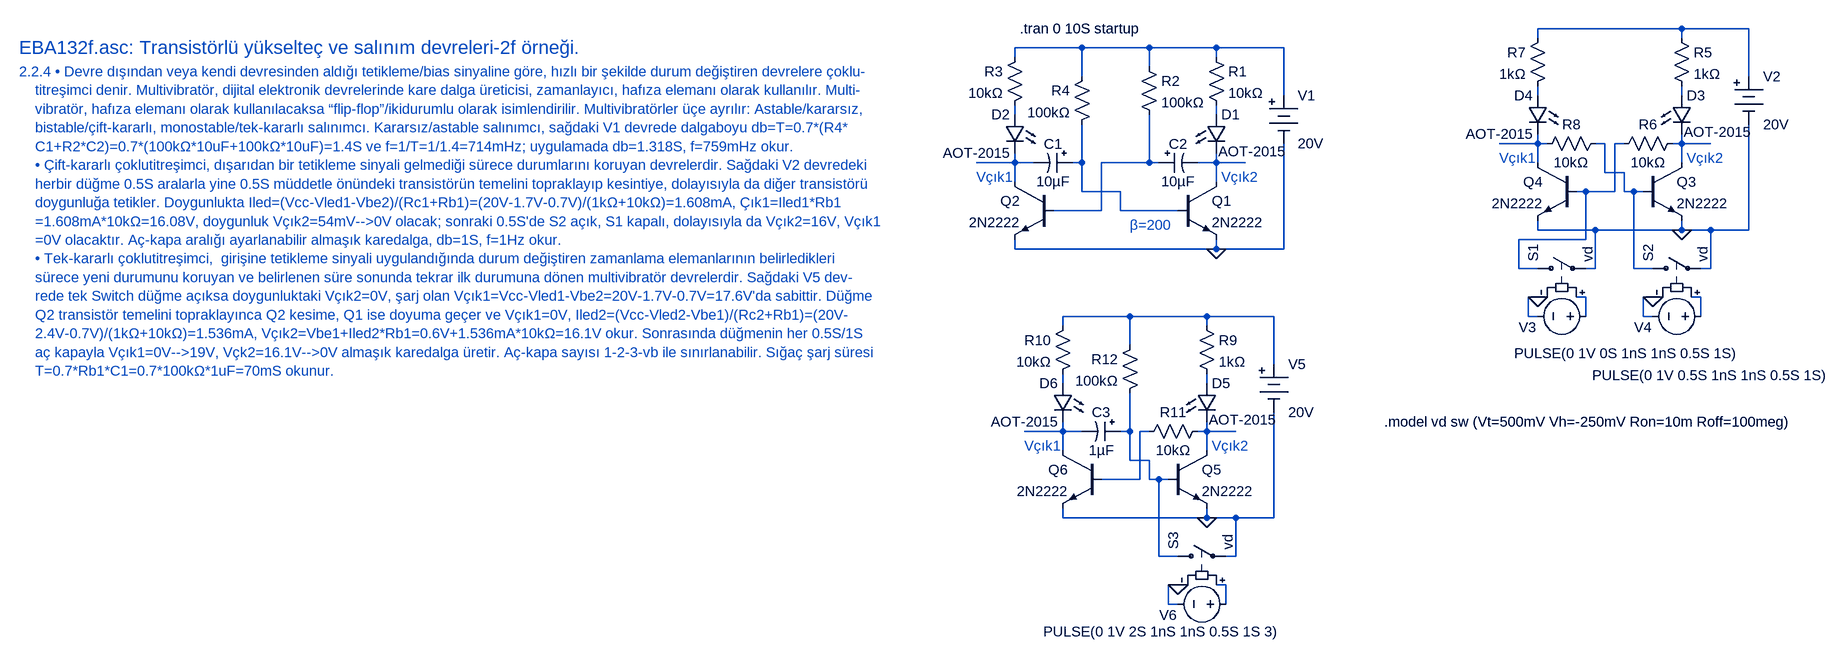
[diagram p0: schematic EBA132f.asc]
EBA132f.asc, the LTspice schematic file:
Version 4
SHEET 1 5332 4332
WIRE 2896 16 2656 16
WIRE 3008 16 2896 16
WIRE 2656 32 2656 16
WIRE 2896 32 2896 16
WIRE 1888 48 1776 48
WIRE 2000 48 1888 48
WIRE 2112 48 2000 48
WIRE 2224 48 2112 48
WIRE 1776 64 1776 48
WIRE 2112 64 2112 48
WIRE 2000 80 2000 48
WIRE 1888 96 1888 48
WIRE 3008 96 3008 16
WIRE 2224 128 2224 48
WIRE 2656 128 2656 112
WIRE 2896 128 2896 112
WIRE 1776 160 1776 144
WIRE 2112 160 2112 144
WIRE 2656 208 2656 192
WIRE 2656 208 2592 208
WIRE 2672 208 2656 208
WIRE 2768 208 2752 208
WIRE 2800 208 2784 208
WIRE 2896 208 2896 192
WIRE 2896 208 2880 208
WIRE 2944 208 2896 208
WIRE 1776 240 1776 224
WIRE 1776 240 1712 240
WIRE 1808 240 1776 240
WIRE 1888 240 1888 176
WIRE 1888 240 1872 240
WIRE 2000 240 2000 160
WIRE 2000 240 1920 240
WIRE 2016 240 2000 240
WIRE 2112 240 2112 224
WIRE 2112 240 2080 240
WIRE 2160 240 2112 240
WIRE 2656 240 2656 208
WIRE 2896 240 2896 208
WIRE 2768 256 2768 208
WIRE 2800 256 2768 256
WIRE 1776 272 1776 240
WIRE 2112 272 2112 240
WIRE 1888 288 1888 240
WIRE 1952 288 1888 288
WIRE 2736 288 2720 288
WIRE 2784 288 2784 208
WIRE 2784 288 2736 288
WIRE 2800 288 2800 256
WIRE 2816 288 2800 288
WIRE 2832 288 2816 288
WIRE 1920 320 1920 240
WIRE 1920 320 1840 320
WIRE 1952 320 1952 288
WIRE 2048 320 1952 320
WIRE 2656 352 2656 336
WIRE 2752 352 2656 352
WIRE 2896 352 2896 336
WIRE 2896 352 2752 352
WIRE 2944 352 2896 352
WIRE 3008 352 3008 176
WIRE 3008 352 2944 352
WIRE 2736 368 2736 288
WIRE 2736 368 2624 368
WIRE 1776 384 1776 368
WIRE 2112 384 2112 368
WIRE 2112 384 1776 384
WIRE 2224 384 2224 208
WIRE 2224 384 2112 384
WIRE 2624 416 2624 368
WIRE 2656 416 2624 416
WIRE 2752 416 2752 352
WIRE 2752 416 2736 416
WIRE 2816 416 2816 288
WIRE 2848 416 2816 416
WIRE 2944 416 2944 352
WIRE 2944 416 2928 416
WIRE 2656 464 2640 464
WIRE 2672 464 2656 464
WIRE 2736 464 2720 464
WIRE 2848 464 2832 464
WIRE 2864 464 2848 464
WIRE 2928 464 2912 464
WIRE 1968 496 1856 496
WIRE 2096 496 1968 496
WIRE 2208 496 2096 496
WIRE 2640 496 2640 464
WIRE 2656 496 2640 496
WIRE 2736 496 2736 464
WIRE 2832 496 2832 464
WIRE 2848 496 2832 496
WIRE 2928 496 2928 464
WIRE 1856 512 1856 496
WIRE 2096 512 2096 496
WIRE 1968 544 1968 496
WIRE 2208 576 2208 496
WIRE 1856 608 1856 592
WIRE 2096 608 2096 592
WIRE 1856 688 1856 672
WIRE 1856 688 1792 688
WIRE 1888 688 1856 688
WIRE 1968 688 1968 624
WIRE 1968 688 1952 688
WIRE 2000 688 1984 688
WIRE 2096 688 2096 672
WIRE 2096 688 2080 688
WIRE 2144 688 2096 688
WIRE 1856 720 1856 688
WIRE 2096 720 2096 688
WIRE 1968 736 1968 688
WIRE 2000 736 1968 736
WIRE 1984 768 1984 688
WIRE 1984 768 1920 768
WIRE 2000 768 2000 736
WIRE 2016 768 2000 768
WIRE 2032 768 2016 768
WIRE 1856 832 1856 816
WIRE 2096 832 2096 816
WIRE 2096 832 1856 832
WIRE 2144 832 2096 832
WIRE 2208 832 2208 656
WIRE 2208 832 2144 832
WIRE 2016 896 2016 768
WIRE 2048 896 2016 896
WIRE 2144 896 2144 832
WIRE 2144 896 2128 896
WIRE 2048 944 2032 944
WIRE 2064 944 2048 944
WIRE 2128 944 2112 944
WIRE 2032 976 2032 944
WIRE 2048 976 2032 976
WIRE 2128 976 2128 944
FLAG 2112 384 0
FLAG 2896 352 0
FLAG 2656 464 0
FLAG 2848 464 0
FLAG 2096 832 0
FLAG 2048 944 0
SYMBOL res 2096 48 R0
SYMATTR InstName R1
SYMATTR Value 10kΩ
SYMBOL npn 2048 272 R0
SYMATTR InstName Q1
SYMATTR Value 2N2222
SYMBOL LED 2096 160 R0
WINDOW 3 19 61 Left 2
SYMATTR Value AOT-2015
SYMATTR InstName D1
SYMATTR Description Diode
SYMATTR Type diode
SYMBOL res 1984 64 R0
SYMATTR InstName R2
SYMATTR Value 100kΩ
SYMBOL res 1792 48 M0
SYMATTR InstName R3
SYMATTR Value 10kΩ
SYMBOL npn 1840 272 M0
SYMATTR InstName Q2
SYMATTR Value 2N2222
SYMBOL LED 1792 160 M0
SYMATTR InstName D2
SYMATTR Value AOT-2015
SYMATTR Description Diode
SYMATTR Type diode
SYMBOL res 1904 80 M0
SYMATTR InstName R4
SYMATTR Value 100kΩ
SYMBOL polcap 1872 224 R90
WINDOW 0 0 32 VBottom 2
WINDOW 3 32 32 VTop 2
SYMATTR InstName C1
SYMATTR Value 10µF
SYMBOL polcap 2016 224 M90
WINDOW 0 0 32 VBottom 2
WINDOW 3 32 32 VTop 2
SYMATTR InstName C2
SYMATTR Value 10µF
SYMBOL Misc\\battery 2224 112 R0
SYMATTR InstName V1
SYMATTR Value 20V
SYMBOL res 2880 16 R0
SYMATTR InstName R5
SYMATTR Value 1kΩ
SYMBOL npn 2832 240 R0
SYMATTR InstName Q3
SYMATTR Value 2N2222
SYMBOL LED 2880 128 R0
WINDOW 3 19 61 Left 2
SYMATTR Value AOT-2015
SYMATTR InstName D3
SYMATTR Description Diode
SYMATTR Type diode
SYMBOL res 2672 16 M0
SYMATTR InstName R7
SYMATTR Value 1kΩ
SYMBOL npn 2720 240 M0
SYMATTR InstName Q4
SYMATTR Value 2N2222
SYMBOL LED 2672 128 M0
SYMATTR InstName D4
SYMATTR Value AOT-2015
SYMATTR Description Diode
SYMATTR Type diode
SYMBOL Misc\\battery 3008 80 R0
SYMATTR InstName V2
SYMATTR Value 20V
SYMBOL res 2896 192 R90
WINDOW 0 0 56 VBottom 2
WINDOW 3 32 56 VTop 2
SYMATTR InstName R6
SYMATTR Value 10kΩ
SYMBOL res 2768 192 R90
WINDOW 0 0 56 VBottom 2
WINDOW 3 32 56 VTop 2
SYMATTR InstName R8
SYMATTR Value 10kΩ
SYMBOL sw 2640 416 R270
WINDOW 0 11 9 Left 2
WINDOW 3 10 100 Left 2
SYMATTR InstName S1
SYMATTR Value vd
SYMBOL voltage 2752 496 R90
WINDOW 0 19 98 VRight 2
WINDOW 3 62 -236 VRight 2
WINDOW 123 0 0 Left 0
WINDOW 39 0 0 Left 0
SYMATTR InstName V3
SYMATTR Value PULSE(0 1V 0S 1nS 1nS 0.5S 1S)
SYMBOL sw 2832 416 R270
WINDOW 0 11 9 Left 2
WINDOW 3 10 100 Left 2
SYMATTR InstName S2
SYMATTR Value vd
SYMBOL voltage 2944 496 R90
WINDOW 0 19 98 VRight 2
WINDOW 3 99 -194 VRight 2
WINDOW 123 0 0 Left 0
WINDOW 39 0 0 Left 0
SYMATTR InstName V4
SYMATTR Value PULSE(0 1V 0.5S 1nS 1nS 0.5S 1S)
SYMBOL res 2080 496 R0
SYMATTR InstName R9
SYMATTR Value 1kΩ
SYMBOL npn 2032 720 R0
SYMATTR InstName Q5
SYMATTR Value 2N2222
SYMBOL LED 2080 608 R0
WINDOW 3 19 61 Left 2
SYMATTR Value AOT-2015
SYMATTR InstName D5
SYMATTR Description Diode
SYMATTR Type diode
SYMBOL Misc\\battery 2208 560 R0
SYMATTR InstName V5
SYMATTR Value 20V
SYMBOL res 2096 672 R90
WINDOW 0 0 56 VBottom 2
WINDOW 3 32 56 VTop 2
SYMATTR InstName R11
SYMATTR Value 10kΩ
SYMBOL sw 2032 896 R270
WINDOW 0 11 9 Left 2
WINDOW 3 10 100 Left 2
SYMATTR InstName S3
SYMATTR Value vd
SYMBOL voltage 2144 976 R90
WINDOW 0 19 98 VRight 2
WINDOW 3 46 -71 VRight 2
WINDOW 123 0 0 Left 0
WINDOW 39 0 0 Left 0
SYMATTR InstName V6
SYMATTR Value PULSE(0 1V 2S 1nS 1nS 0.5S 1S 3)
SYMBOL res 1872 496 M0
SYMATTR InstName R10
SYMATTR Value 10kΩ
SYMBOL npn 1920 720 M0
SYMATTR InstName Q6
SYMATTR Value 2N2222
SYMBOL LED 1872 608 M0
SYMATTR InstName D6
SYMATTR Value AOT-2015
SYMATTR Description Diode
SYMATTR Type diode
SYMBOL res 1984 528 M0
SYMATTR InstName R12
SYMATTR Value 100kΩ
SYMBOL polcap 1952 672 R90
WINDOW 0 0 32 VBottom 2
WINDOW 3 32 32 VTop 2
SYMATTR InstName C3
SYMATTR Value 1µF
TEXT -224 48 Left 3 ;EBA132f.asc: Transistörlü yükselteç ve salınım devreleri-2f örneği.
TEXT -224 88 Left 2 ;2.2.4 • Devre dışından veya kendi devresinden aldığı tetikleme/bias sinyaline göre, hızlı bir şekilde durum değiştiren devrelere çoklu-\n    titreşimci denir. Multivibratör, dijital elektronik devrelerinde kare dalga üreticisi, zamanlayıcı, hafıza elemanı olarak kullanılır. Multi-\n    vibratör, hafıza elemanı olarak kullanılacaksa “flip-flop”/ikidurumlu olarak isimlendirilir. Multivibratörler üçe ayrılır: Astable/kararsız,\n    bistable/çift-kararlı, monostable/tek-kararlı salınımcı. Kararsız/astable salınımcı, sağdaki V1 devrede dalgaboyu db=T=0.7*(R4*\n    C1+R2*C2)=0.7*(100kΩ*10uF+100kΩ*10uF)=1.4S ve f=1/T=1/1.4=714mHz; uygulamada db=1.318S, f=759mHz okur.\n    • Çift-kararlı çoklutitreşimci, dışarıdan bir tetikleme sinyali gelmediği sürece durumlarını koruyan devrelerdir. Sağdaki V2 devredeki\n    herbir düğme 0.5S aralarla yine 0.5S müddetle önündeki transistörün temelini topraklayıp kesintiye, dolayısıyla da diğer transistörü\n    doygunluğa tetikler. Doygunlukta Iled=(Vcc-Vled1-Vbe2)/(Rc1+Rb1)=(20V-1.7V-0.7V)/(1kΩ+10kΩ)=1.608mA, Çık1=Iled1*Rb1\n    =1.608mA*10kΩ=16.08V, doygunluk Vçık2=54mV-->0V olacak; sonraki 0.5S'de S2 açık, S1 kapalı, dolayısıyla da Vçık2=16V, Vçık1\n    =0V olacaktır. Aç-kapa aralığı ayarlanabilir almaşık karedalga, db=1S, f=1Hz okur.\n    • Tek-kararlı çoklutitreşimci,  girişine tetikleme sinyali uygulandığında durum değiştiren zamanlama elemanlarının belirledikleri \n    sürece yeni durumunu koruyan ve belirlenen süre sonunda tekrar ilk durumuna dönen multivibratör devrelerdir. Sağdaki V5 dev-\n    rede tek Switch düğme açıksa doygunluktaki Vçık2=0V, şarj olan Vçık1=Vcc-Vled1-Vbe2=20V-1.7V-0.7V=17.6V'da sabittir. Düğme\n    Q2 transistör temelini topraklayınca Q2 kesime, Q1 ise doyuma geçer ve Vçık1=0V, Iled2=(Vcc-Vled2-Vbe1)/(Rc2+Rb1)=(20V-\n    2.4V-0.7V)/(1kΩ+10kΩ)=1.536mA, Vçık2=Vbe1+Iled2*Rb1=0.6V+1.536mA*10kΩ=16.1V okur. Sonrasında düğmenin her 0.5S/1S\n    aç kapayla Vçık1=0V-->19V, Vçk2=16.1V-->0V almaşık karedalga üretir. Aç-kapa sayısı 1-2-3-vb ile sınırlanabilir. Sığaç şarj süresi\n    T=0.7*Rb1*C1=0.7*100kΩ*1uF=70mS okunur.
TEXT 1968 344 Left 2 ;β=200
TEXT 1712 264 Left 2 ;Vçık1
TEXT 2120 264 Left 2 ;Vçık2
TEXT 1784 16 Left 2 !.tran 0 10S startup
TEXT 2592 232 Left 2 ;Vçık1
TEXT 2904 232 Left 2 ;Vçık2
TEXT 2400 672 Left 2 !.model vd sw (Vt=500mV Vh=-250mV Ron=10m Roff=100meg)
TEXT 2104 712 Left 2 ;Vçık2
TEXT 1792 712 Left 2 ;Vçık1

The netlist it stands for:
* EBA132f.asc
R1 N002 N006 10kΩ
Q1 N014 N012 0 0 2N2222
D1 N006 N014 AOT-2015
R2 N002 N013 100kΩ
R3 N002 N005 10kΩ
Q2 N011 N013 0 0 2N2222
D2 N005 N011 AOT-2015
R4 N002 N012 100kΩ
C1 N012 N011 10µF
C2 N013 N014 10µF
V1 N002 0 20V
R5 N001 N004 1kΩ
Q3 N010 N008 0 0 2N2222
D3 N004 N010 AOT-2015
R7 N001 N003 1kΩ
Q4 N007 N009 0 0 2N2222
D4 N003 N007 AOT-2015
V2 N001 0 20V
R6 N010 N009 10kΩ
R8 N008 N007 10kΩ
S1 N009 0 N015 0 vd
V3 N015 0 PULSE(0 1V 0S 1nS 1nS 0.5S 1S)
S2 N008 0 N016 0 vd
V4 N016 0 PULSE(0 1V 0.5S 1nS 1nS 0.5S 1S)
R9 N017 N019 1kΩ
Q5 N023 N021 0 0 2N2222
D5 N019 N023 AOT-2015
V5 N017 0 20V
R11 N023 N022 10kΩ
S3 N021 0 N024 0 vd
V6 N024 0 PULSE(0 1V 2S 1nS 1nS 0.5S 1S 3)
R10 N017 N018 10kΩ
Q6 N020 N022 0 0 2N2222
D6 N018 N020 AOT-2015
R12 N017 N021 100kΩ
C3 N021 N020 1µF
.model D D
.lib standard.dio
.model NPN NPN
.model PNP PNP
.lib standard.bjt
* EBA132f.asc: Transistörlü yükselteç ve salınım devreleri-2f örneği.
* 2.2.4 • Devre dışından veya kendi devresinden aldığı tetikleme/bias sinyaline göre, hızlı bir şekilde durum değiştiren devrelere çoklu-
*     titreşimci denir. Multivibratör, dijital elektronik devrelerinde kare dalga üreticisi, zamanlayıcı, hafıza elemanı olarak kullanılır. Multi-
*     vibratör, hafıza elemanı olarak kullanılacaksa “flip-flop”/ikidurumlu olarak isimlendirilir. Multivibratörler üçe ayrılır: Astable/kararsız,
*     bistable/çift-kararlı, monostable/tek-kararlı salınımcı. Kararsız/astable salınımcı, sağdaki V1 devrede dalgaboyu db=T=0.7*(R4*
*     C1+R2*C2)=0.7*(100kΩ*10uF+100kΩ*10uF)=1.4S ve f=1/T=1/1.4=714mHz; uygulamada db=1.318S, f=759mHz okur.
*     • Çift-kararlı çoklutitreşimci, dışarıdan bir tetikleme sinyali gelmediği sürece durumlarını koruyan devrelerdir. Sağdaki V2 devredeki
*     herbir düğme 0.5S aralarla yine 0.5S müddetle önündeki transistörün temelini topraklayıp kesintiye, dolayısıyla da diğer transistörü
*     doygunluğa tetikler. Doygunlukta Iled=(Vcc-Vled1-Vbe2)/(Rc1+Rb1)=(20V-1.7V-0.7V)/(1kΩ+10kΩ)=1.608mA, Çık1=Iled1*Rb1
*     =1.608mA*10kΩ=16.08V, doygunluk Vçık2=54mV-->0V olacak; sonraki 0.5S'de S2 açık, S1 kapalı, dolayısıyla da Vçık2=16V, Vçık1
*     =0V olacaktır. Aç-kapa aralığı ayarlanabilir almaşık karedalga, db=1S, f=1Hz okur.
*     • Tek-kararlı çoklutitreşimci,  girişine tetikleme sinyali uygulandığında durum değiştiren zamanlama elemanlarının belirledikleri
*     sürece yeni durumunu koruyan ve belirlenen süre sonunda tekrar ilk durumuna dönen multivibratör devrelerdir. Sağdaki V5 dev-
*     rede tek Switch düğme açıksa doygunluktaki Vçık2=0V, şarj olan Vçık1=Vcc-Vled1-Vbe2=20V-1.7V-0.7V=17.6V'da sabittir. Düğme
*     Q2 transistör temelini topraklayınca Q2 kesime, Q1 ise doyuma geçer ve Vçık1=0V, Iled2=(Vcc-Vled2-Vbe1)/(Rc2+Rb1)=(20V-
*     2.4V-0.7V)/(1kΩ+10kΩ)=1.536mA, Vçık2=Vbe1+Iled2*Rb1=0.6V+1.536mA*10kΩ=16.1V okur. Sonrasında düğmenin her 0.5S/1S
*     aç kapayla Vçık1=0V-->19V, Vçk2=16.1V-->0V almaşık karedalga üretir. Aç-kapa sayısı 1-2-3-vb ile sınırlanabilir. Sığaç şarj süresi
*     T=0.7*Rb1*C1=0.7*100kΩ*1uF=70mS okunur.
* β=200
* Vçık1
* Vçık2
.tran 0 10S startup
* Vçık1
* Vçık2
.model vd sw (Vt=500mV Vh=-250mV Ron=10m Roff=100meg)
* Vçık2
* Vçık1
.backanno
.end